# EAGLE design untitled (EAGLE 6.1)
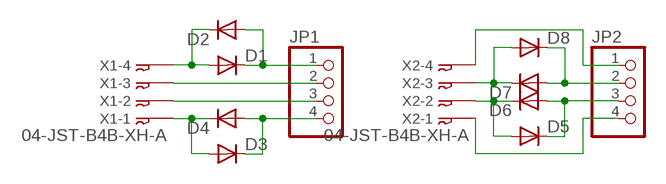
[diagram p0: schematic, sheet 1]

## Parts
D1  DIODE-SMB  [SMB]
D2  DIODE-SMB  [SMB]
D3  DIODE-SMB  [SMB]
D4  DIODE-SMB  [SMB]
D5  DIODE-SMC  [SMC]
D6  DIODE-SMC  [SMC]
D7  DIODE-SMC  [SMC]
D8  DIODE-SMC  [SMC]
JP1  PINHD-1X4  [1X04]
JP2  PINHD-1X4  [1X04]
X1  04-JST-B4B-XH-A  [B4B-XH]
X2  04-JST-B4B-XH-A  [B4B-XH]

## Nets
N$1: JP1.3 X1.P$2
N$2: JP1.2 X1.P$3
N$3: D1.C D2.A JP1.1
N$4: D1.A D2.C X1.P$4
N$5: D3.A D4.C X1.P$1
N$6: D3.C D4.A JP1.4
N$7: JP2.4 X2.P$1
N$8: JP2.1 X2.P$4
N$9: D7.A D8.C JP2.2
N$10: D7.C D8.A X2.P$3
N$11: D5.A D6.C X2.P$2
N$12: D5.C D6.A JP2.3

## Library data of the parts
D1-D8 = diode:DIODE-: DIODE
JP1 JP2 = pinhead:PINHD-1X4: PIN HEADER
X1 X2 = bt_con-jst-xh:04-JST: JST CONNECTOR

## Board
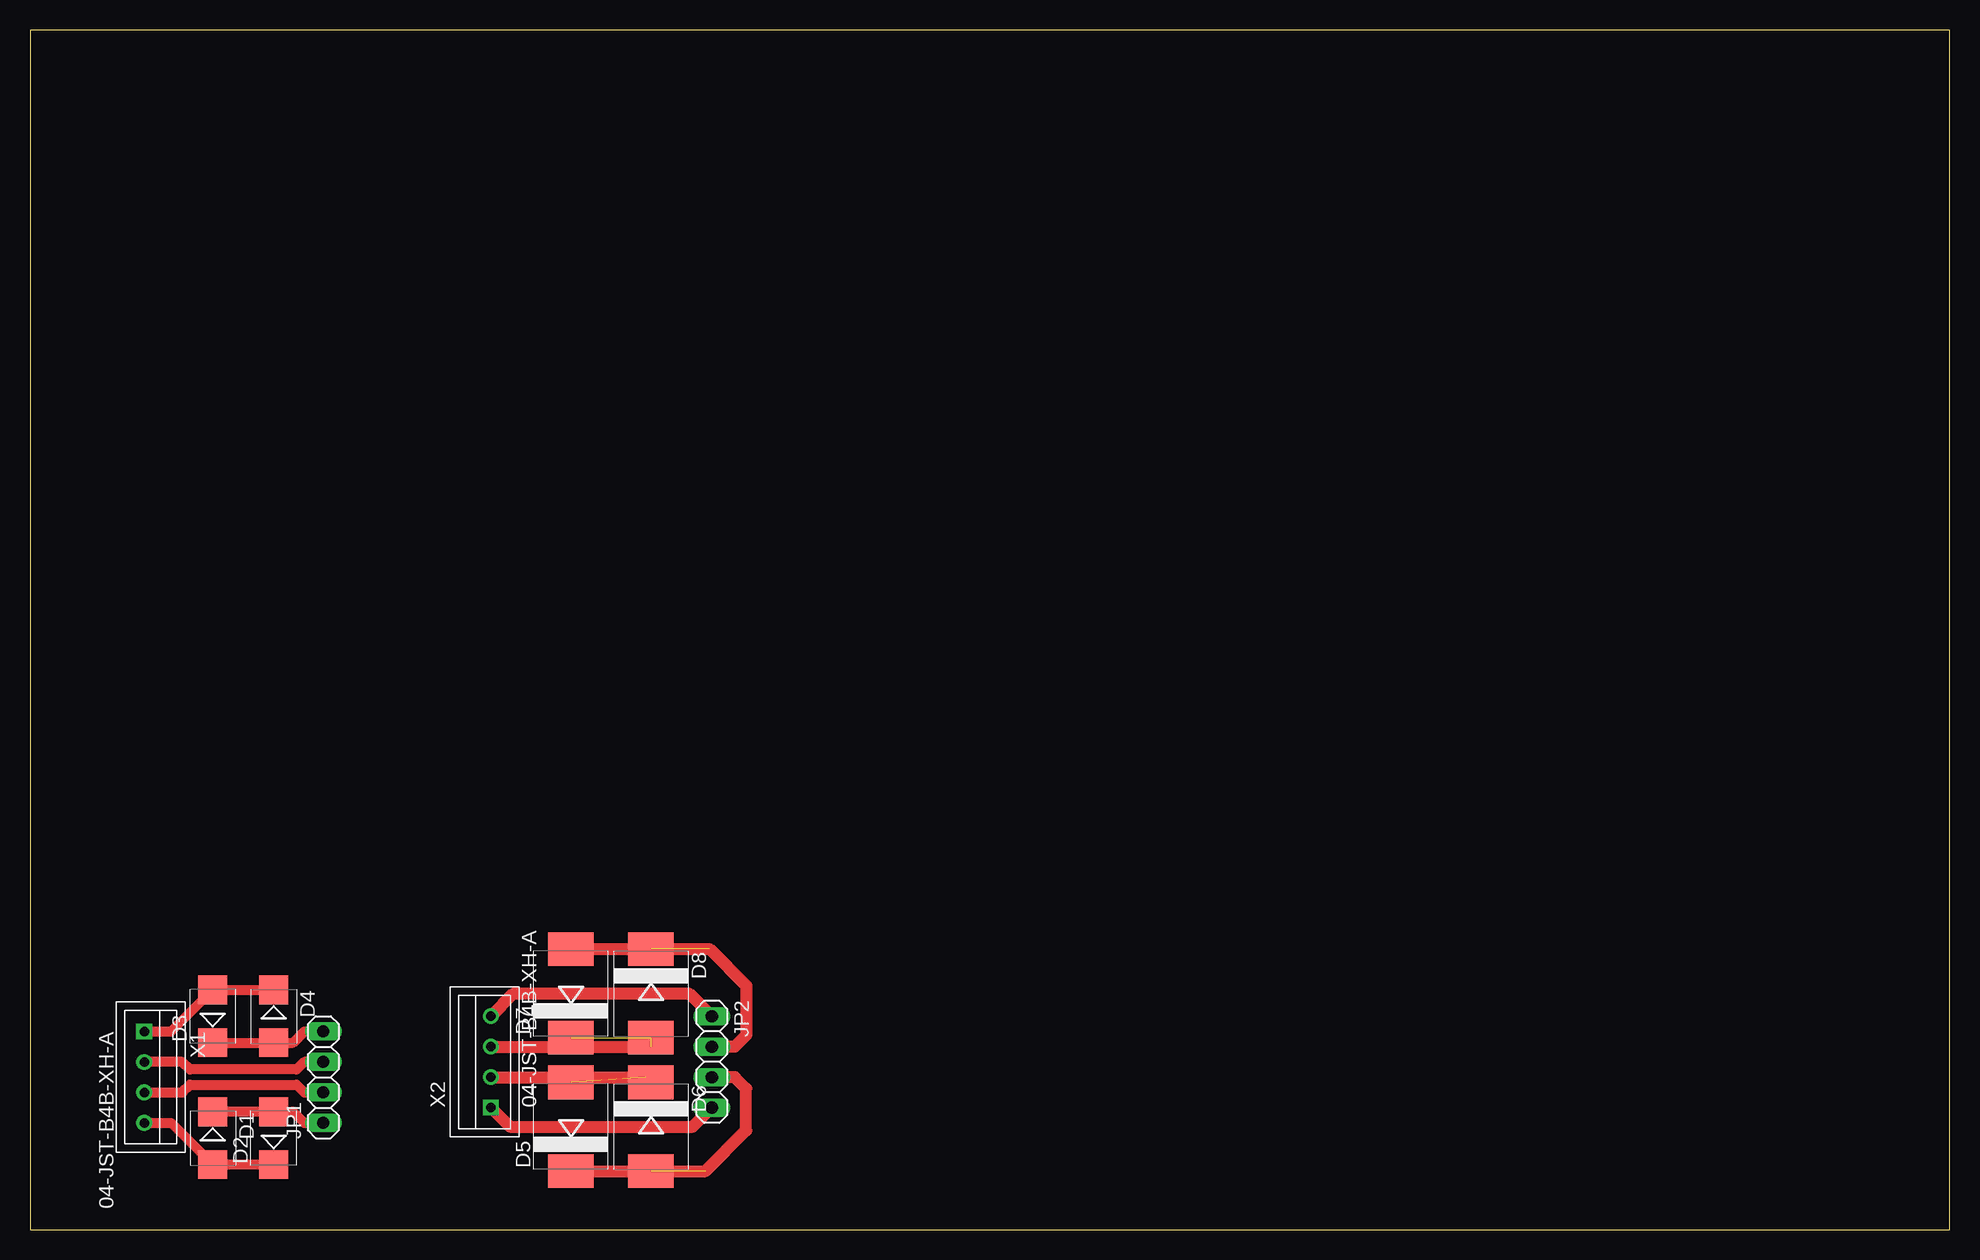
[diagram p1: board, top side]

Size 160 x 100 mm. Coordinates in mm from the lower left corner, seen from the top.
Outline: 0,0 160,0 160,100 0,100 0,0
Copper layers (1*16): Top 0.035mm / dielectric 1.5mm / Bottom 0.035mm
Design rules: minimum track width 10mil, minimum drill 24mil, track to track 12mil, track to pad 12mil, pad to pad 12mil, via to via 12mil, smd to smd 10mil, copper to edge 12mil, drill to drill 12mil, minimum pad ring 10mil, minimum via ring 10mil, stop-mask expansion 4mil, vias tented up to drill 0mil, thermal gap 12mil

### Footprints (pad centres in the part's own frame; a part is rotated, then mirrored left to right if it is on the bottom)
SMB = smd 2.4 x 2.4: A 2.2,0; C -2.2,0
SMC = smd 2.8 x 3.8: A 3.7,0; C -3.7,0
1X04 = drill 1.016 long: 1 -3.81,0; 2 -1.27,0; 3 1.27,0; 4 3.81,0
B4B-XH = drill 0.8 square: P$1 -3.81,0 | drill 0.8: P$2 -1.27,0; P$3 1.27,0; P$4 3.81,0

### Placement (x,y rotation side)
D1  15.24,7.62 270 top
D2  20.32,7.62 90 top
D3  15.24,17.78 90 top
D4  20.32,17.78 270 top
D5  45.09,8.57 90 top
D6  51.75,8.57 270 top
D7  45.09,19.68 90 top
D8  51.75,19.68 270 top
JP1  24.45,12.7 90 top
JP2  56.83,13.97 270 top
X1  9.53,12.7 270 top
X2  38.42,13.97 90 top

### Tracks (layer width: path | path; a pad name or v marks a point on that pad's centre or on a via)
N$1
  Top 0.813: JP1.3 22.86,13.97 22.23,13.34 13.34,13.34 12.7,13.97 X1.P$2
N$2
  Top 0.813: X1.P$3 12.7,11.43 13.34,12.06 22.23,12.06 22.86,11.43 JP1.2
N$3
  Top 0.813: JP1.1 22.86,8.89 21.93,9.82 D2.A 15.9,9.82 15.88,9.84 15.26,9.84 D1.C
N$4
  Top 0.813: X1.P$4 11.77,8.89 D1.A D2.C
N$5
  Top 0.813: X1.P$1 11.77,16.51 D3.A D4.C
N$6
  Top 0.813: D3.C D4.A 21.93,15.58 22.86,16.51 JP1.4
N$7
  Top 1.016: X2.P$1 40.01,8.57 55.24,8.57 JP2.4
N$8
  Top 1.016: X2.P$4 40.32,19.68 54.93,19.68 JP2.1
N$9  (1 unrouted)
  Top 1.016: D7.A 56.62,23.39 59.69,20.32 59.69,16.19 58.74,15.24 JP2.2
N$10  (2 unrouted)
  Top 1.016: X2.P$3 51.75,15.24
N$11  (1 unrouted)
  Top 1.016: X2.P$2 51.33,12.7 D6.C
N$12  (1 unrouted)
  Top 1.016: D5.C 56.31,4.87 59.69,8.26 59.69,11.75 58.74,12.7 JP2.3